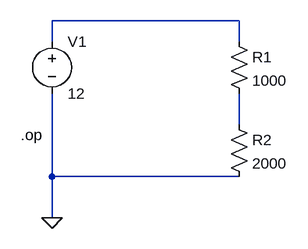
[diagram p0: schematic 3_Voltage division in a series circuit.asc]
3_Voltage division in a series circuit.asc, the LTspice schematic file:
Version 4.1
SHEET 1 880 680
WIRE 448 144 160 144
WIRE 160 176 160 144
WIRE 448 176 448 144
WIRE 448 304 448 256
WIRE 160 384 160 256
WIRE 448 384 160 384
WIRE 160 448 160 384
FLAG 160 448 0
DATAFLAG 432 384 ""
DATAFLAG 448 304 ""
DATAFLAG 448 160 ""
DATAFLAG 448 256 ""
SYMBOL voltage 160 160 R0
WINDOW 123 0 0 Left 0
WINDOW 39 0 0 Left 0
SYMATTR InstName V1
SYMATTR Value 12
SYMBOL res 432 160 R0
SYMATTR InstName R1
SYMATTR Value 1000
SYMBOL res 432 288 R0
SYMATTR InstName R2
SYMATTR Value 2000
TEXT 112 320 Left 2 !.op

The netlist it stands for:
* 3_Voltage division in a series circuit.asc
V1 N001 0 12
R1 N001 N002 1000
R2 N002 0 2000
.op
.backanno
.end